# EAGLE design usb (EAGLE 9.2.2)
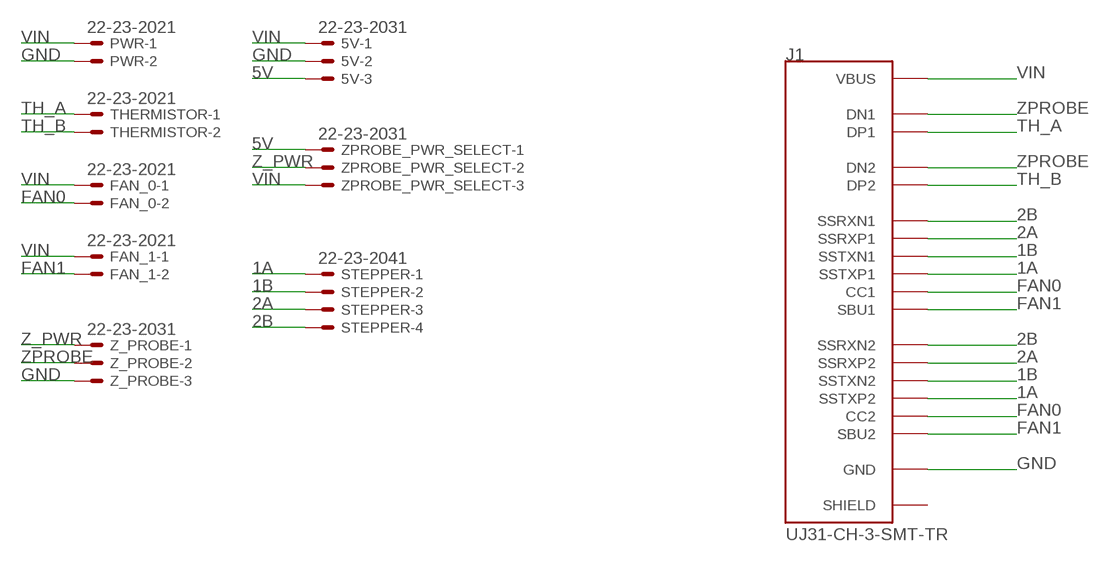
[diagram p0: schematic, sheet 1]

## Parts
5V  22-23-2031  [22-23-2031]
FAN_0  22-23-2021  [22-23-2021]
FAN_1  22-23-2021  [22-23-2021]
J1  UJ31-CH-3-SMT-TR  [CUI_UJ31-CH-3-SMT-TR]
PWR  22-23-2021  [22-23-2021]
STEPPER  22-23-2041  [22-23-2041]
THERMISTOR  22-23-2021  [22-23-2021]
Z_PROBE  22-23-2031  [22-23-2031]
ZPROBE_PWR_SELECT  22-23-2031  [22-23-2031]

## Nets
1A: J1.A2(SSTXP1) J1.B2(SSTXP2) STEPPER.1
1B: J1.A3(SSTXN1) J1.B3(SSTXN2) STEPPER.2
2A: J1.A11(SSRXP2) J1.B11(SSRXP1) STEPPER.3
2B: J1.A10(SSRXN2) J1.B10(SSRXN1) STEPPER.4
5V: 5V.3 ZPROBE_PWR_SELECT.1
FAN0: FAN_0.2 J1.A5(CC1) J1.B5(CC2)
FAN1: FAN_1.2 J1.A8(SBU1) J1.B8(SBU2)
GND: 5V.2 J1.A1(GND) J1.A12(GND) J1.B1(GND) J1.B12(GND) PWR.2 Z_PROBE.3
TH_A: J1.A6(DP1) THERMISTOR.1
TH_B: J1.B6(DP2) THERMISTOR.2
VIN: 5V.1 FAN_0.1 FAN_1.1 J1.A4(VBUS) J1.A9(VBUS) J1.B4(VBUS) J1.B9(VBUS) PWR.1 ZPROBE_PWR_SELECT.3
Z_PWR: Z_PROBE.1 ZPROBE_PWR_SELECT.2
ZPROBE: J1.A7(DN1) J1.B7(DN2) Z_PROBE.2

## Power pins joined to a net without a drawn wire
SHIELD: J1.SH1(SHIELD) J1.SH2(SHIELD) J1.SH3(SHIELD) J1.SH4(SHIELD) J1.SH5(SHIELD) J1.SH6(SHIELD)

## Library data of the parts
5V Z_PROBE ZPROBE_PWR_SELECT = con-molex:22-23-2031: .100" (2.54mm) Center Header - 3 Pin; MF: MOLEX; MPN: 22-23-2031; OC_FARNELL: 1462950; OC_NEWARK: 30C0862
FAN_0 FAN_1 PWR THERMISTOR = con-molex:22-23-2021: .100" (2.54mm) Center Header - 2 Pin; MF: MOLEX; MPN: 22-23-2021; OC_FARNELL: 1462926; OC_NEWARK: 25C3832
J1 = UJ31-CH-3-SMT-TR:UJ31-CH-3-SMT-TR: Type C, USB 3.0/3.1 Gen 1, Right Angle, Surface Mount (SMT), USB Receptacle; MANUFACTURER: CUI INC; PART_REV: 1.01; STANDARD: MANUFACTURER RECOMMENDATIONS
STEPPER = con-molex:22-23-2041: .100" (2.54mm) Center Header - 4 Pin; MF: MOLEX; MPN: 22-23-2041; OC_FARNELL: 1462920; OC_NEWARK: 38C0355

## Board
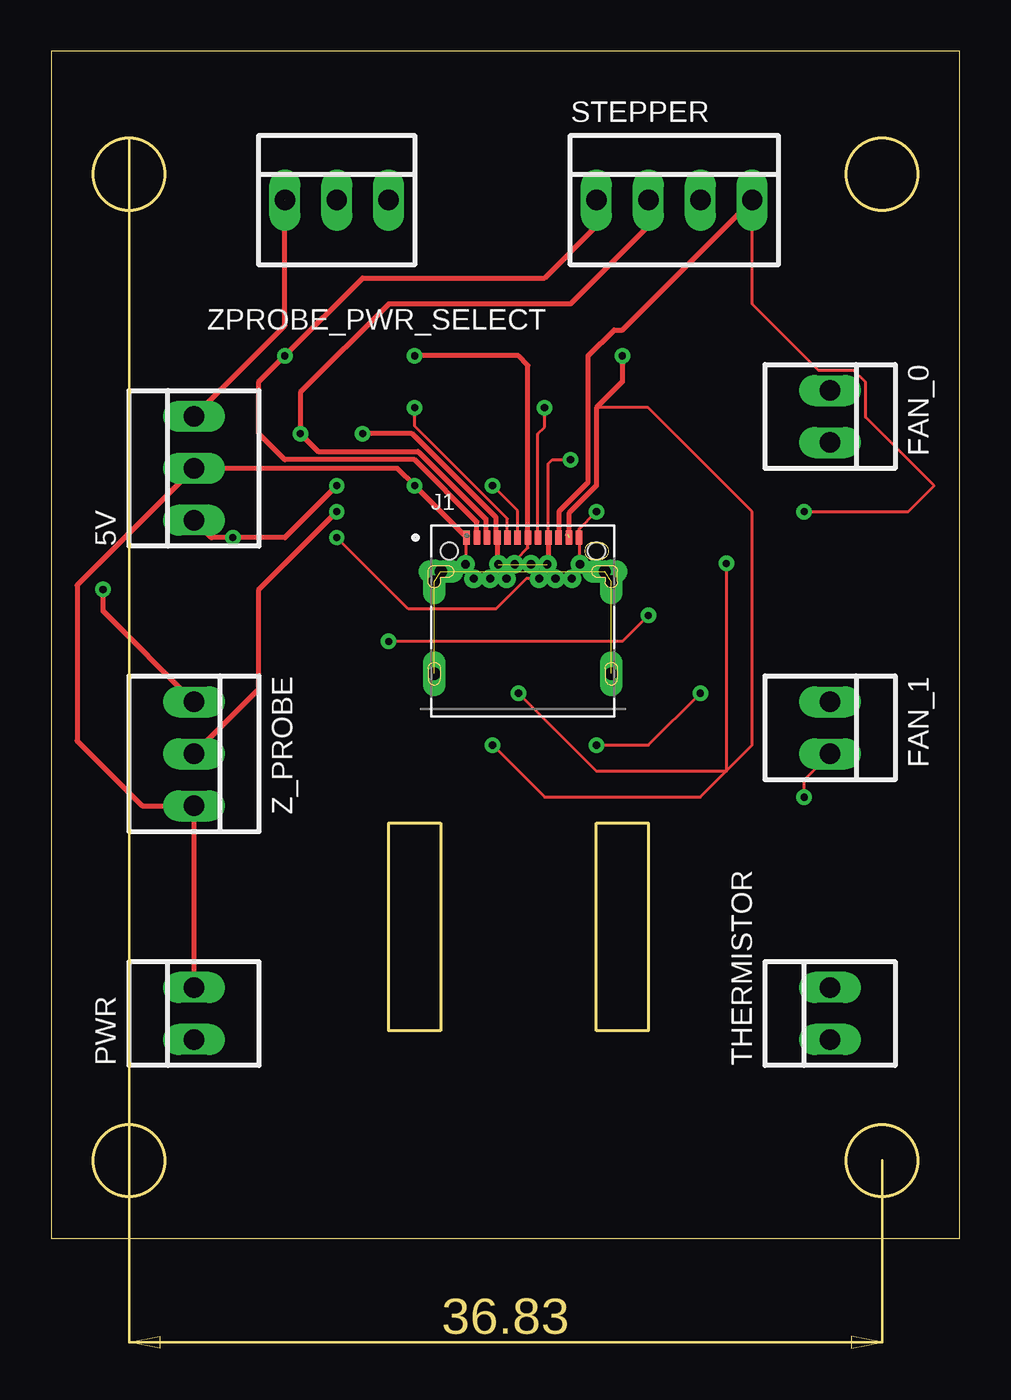
[diagram p1: board, top side]
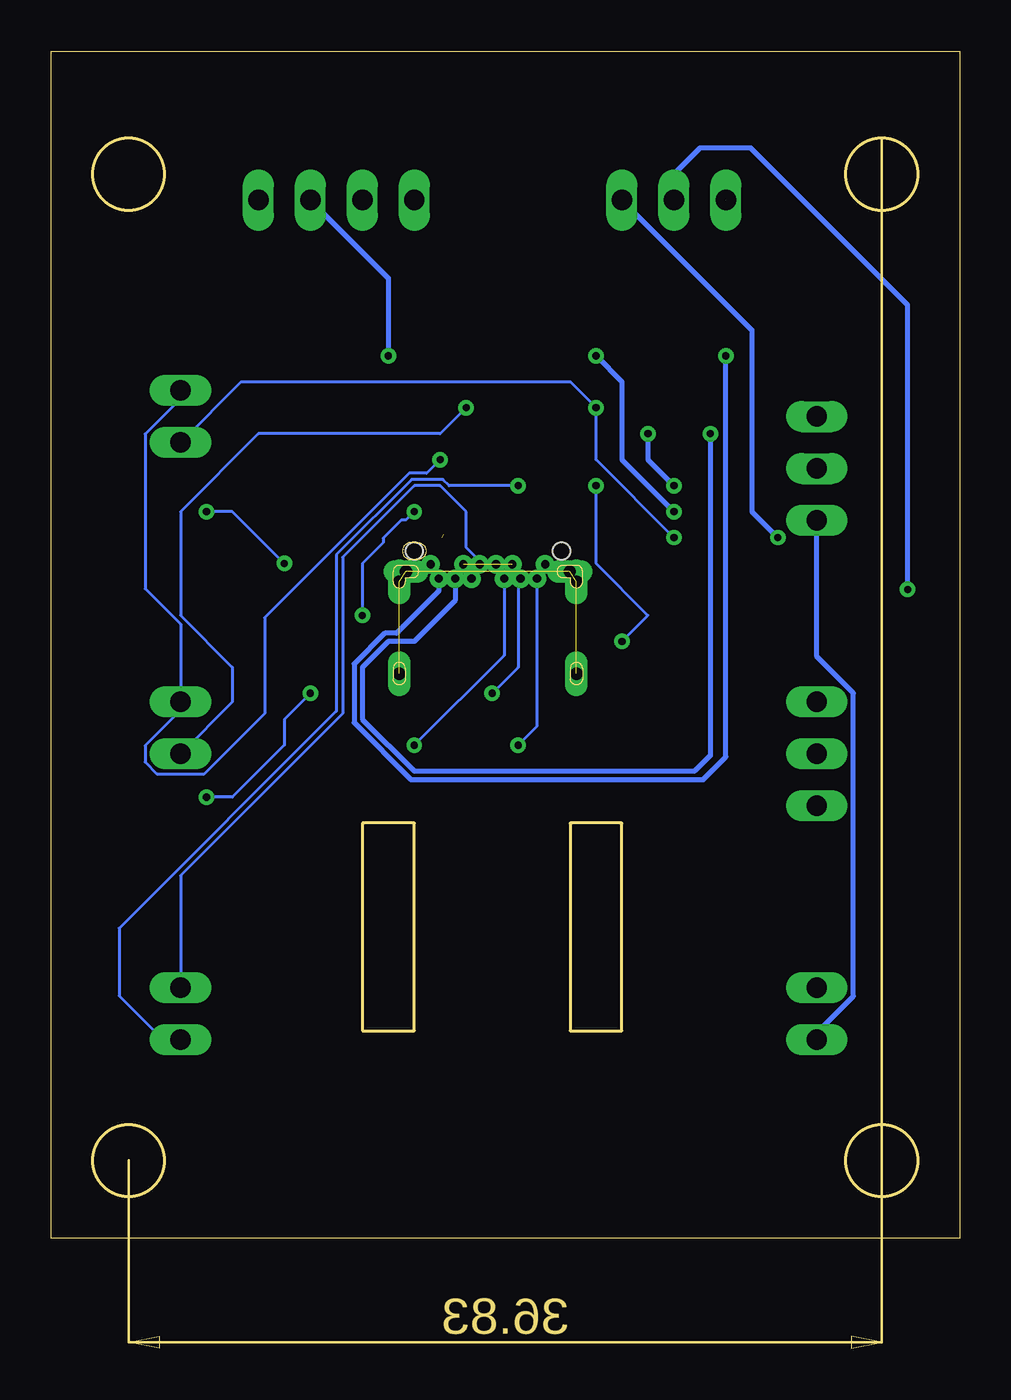
[diagram p2: board, bottom side, seen from below]

Size 44.43 x 58.09 mm. Coordinates in mm from the lower left corner, seen from the top.
Outline: 0,0 44.43,0 44.43,58.09 0,58.09 0,0
Outline: 16.51,20.32 19.05,20.32 19.05,10.16 16.51,10.16 16.51,20.32
Outline: 26.67,20.32 29.21,20.32 29.21,10.16 26.67,10.16 26.67,20.32
Outline: circle at 3.81,52.07 radius 1.75
Outline: circle at 40.64,52.07 radius 1.75
Outline: circle at 3.81,3.81 radius 1.75
Outline: circle at 40.64,3.81 radius 1.75
Copper layers (1*16): Top 0.035mm / dielectric 1.5mm / Bottom 0.035mm
Design rules "default": minimum track width 6mil, minimum drill 0.35mm, track to track 6mil, track to pad 6mil, pad to pad 6mil, via to via 6mil, smd to smd 6mil, copper to edge 40mil, drill to drill 6mil, minimum pad ring 10mil, minimum via ring 8mil, stop-mask expansion 4mil, vias tented up to drill 0mil, thermal gap 10mil

### Footprints (pad centres in the part's own frame; a part is rotated, then mirrored left to right if it is on the bottom)
22-23-2031 = drill 1 long: 1 -2.54,0; 2 0,0; 3 2.54,0
22-23-2021 = drill 1 long: 1 -1.27,0; 2 1.27,0
CUI_UJ31-CH-3-SMT-TR = smd 0.32 x 0.7: A1 0,0; A2 0.5,0; A3 1,0; A4 1.5,0; A5 2,0; A6 2.5,0; A7 3,0; A8 3.5,0; A9 4,0; A10 4.5,0; A11 5,0; A12 5.5,0 | drill 0.4 pad 0.6: B1 5.55,-1.31; B2 5.15,-2.01; B3 4.35,-2.01; B4 3.95,-1.31; B5 3.55,-2.01; B6 3.15,-1.31; B7 2.35,-1.31; B8 1.95,-2.01; B9 1.55,-1.31; B10 1.15,-2.01; B11 0.35,-2.01; B12 -0.05,-1.31 | drill 0.6 pad 0.8 long: SH1 -1.255,-1.66; SH2 6.755,-1.66 | drill 0.6 pad 0.9 long: SH3 -1.58,-2.16; SH4 7.08,-2.16; SH5 -1.58,-6.66; SH6 7.08,-6.66 | hole 0.85: -0.85,-0.66; 6.35,-0.66
22-23-2041 = drill 1 long: 1 -3.81,0; 2 -1.27,0; 3 1.27,0; 4 3.81,0

### Placement (x,y rotation side)
5V  6.99,37.68 90 top
FAN_0  38.1,40.22 270 top
FAN_1  38.1,24.98 270 top
J1  20.32,34.29 0 top
PWR  6.99,11.01 90 top
STEPPER  30.48,50.8 0 top
THERMISTOR  38.1,11.01 90 top
Z_PROBE  6.99,23.71 270 top
ZPROBE_PWR_SELECT  13.97,50.8 0 top

### Tracks (layer width: path | path; a pad name or v marks a point on that pad's centre or on a via)
1A  (via drill 0.35)
  Top 0.254: J1.A2 20.82,35.06 17.78,38.1 11.43,38.1 10.16,39.37 10.16,41.91 v11.43,43.18 15.24,46.99 24.13,46.99 26.67,49.53 | STEPPER.1 26.67,49.53 | 26.67,49.53
  Bottom 0.254: J1.B2 25.47,31.68 27.53,29.62 28.11,29.62 29.62,28.11 29.62,25.23 26.84,22.45 12.53,22.45 11.43,23.55 v11.43,43.18
1B  (via drill 0.35)
  Top 0.254: STEPPER.2 29.21,49.53 25.4,45.72 16.51,45.72 12.19,41.4 v12.19,39.37 13.06,38.51 17.95,38.51 21.26,35.2 21.26,34.35 J1.A3
  Bottom 0.254: v12.19,39.37 12.19,23.62 12.95,22.86 26.67,22.86 29.21,25.4 29.21,27.94 27.94,29.21 26.67,29.21 24.67,31.21 J1.B3
2A  (via drill 0.35)  (1 unrouted)
  Top 0.152: v21.59,24.13 24.13,21.59 31.75,21.59 34.29,24.13 34.29,35.56 29.21,40.64 26.67,40.64
  Top 0.254: v27.94,43.18 27.94,41.91 26.67,40.64 26.67,36.83 25.32,35.48 25.32,34.5 25.26,34.44
  Bottom 0.152: J1.B11 20.67,25.05 v21.59,24.13
  Bottom 0.254: STEPPER.3 27.94,46.99 v27.94,43.18
2B  (via drill 0.35)
  Top 0.152: v22.86,26.67 26.67,22.86 33.02,22.86 v33.02,33.02 | v36.83,35.56 41.91,35.56 43.18,36.83 39.84,40.17 39.84,41.89 39.26,42.47 37.54,42.47 34.29,45.72 STEPPER.4
  Top 0.254: STEPPER.4 27.94,44.45 27.53,44.45 26.26,43.18 26.26,37 24.85,35.59 24.85,34.32 J1.A10
  Bottom 0.152: v22.86,26.67 21.59,27.94 21.59,32.16 J1.B10 | v33.02,33.02 35.56,35.56 v36.83,35.56
5V  (1 unrouted)
  Top 0.254: 5V.3 11.43,44.66 ZPROBE_PWR_SELECT.1
FAN0  (via drill 0.35)
  Top 0.152: J1.A5 22.32,35.21 17.78,39.75 v17.78,40.64 | J1.B5 23.23,32.28 21.75,30.79 17.47,30.79 v13.97,34.29
  Bottom 0.152: FAN_0.2 35.14,41.91 19.05,41.91 v17.78,40.64 17.78,38.1 v13.97,34.29
FAN1  (via drill 0.35)
  Top 0.152: J1.A8 23.8,34.31 23.8,39.37 24.13,39.7 v24.13,40.64 | v26.67,24.13 29.21,24.13 v31.75,26.67 | v36.83,21.59 36.83,22.44 FAN_1.2
  Bottom 0.152: FAN_1.2 35.56,26.25 35.56,27.94 38.1,30.48 38.1,35.56 34.29,39.37 25.4,39.37 v24.13,40.64 | J1.B8 22.27,28.53 v26.67,24.13 | v31.75,26.67 33.02,25.4 33.02,24.13 35.56,21.59 v36.83,21.59
GND  (via drill 0.35)
  Top 0.152: v26.67,35.56 25.82,34.71 J1.A12 25.82,33.03 J1.B1 | J1.A1 20.27,34.24 J1.B12 | v29.21,30.48 27.94,29.21 v16.51,29.21
  Top 0.254: J1.A1 v17.78,36.83 16.93,37.68 5V.2 1.27,31.96 1.27,24.34 4.45,21.17 Z_PROBE.3 PWR.2
  Bottom 0.152: v26.67,35.56 27.08,35.15 27.3,35.15 28.19,34.26 28.19,34.04 29.21,33.02 v29.21,30.48 | v16.51,29.21 15.24,30.48 17.78,33.02 v17.78,36.83
SHIELD  (5 unrouted)
TH_A  (via drill 0.35)
  Top 0.152: J1.A6 22.82,35.6 v21.59,36.83
  Bottom 0.152: v21.59,36.83 24.97,36.83 25.27,37.13 26.8,37.13 30.48,33.45 30.48,33.02 | 30.48,33.02 | 30.48,33.02 30.48,25.8 41.11,15.18 41.11,11.87 38.97,9.74 THERMISTOR.1
TH_B
  Bottom 0.152: J1.B6 23.59,33.1 23.59,33.26 24.13,33.8 24.13,35.56 25.4,36.83 26.67,36.83 30.18,33.33 30.18,25.68 38.1,17.75 THERMISTOR.2
VIN  (via drill 0.35)  (1 unrouted)
  Top 0.152: J1.A9 24.32,37.91 24.51,38.1 v25.4,38.1
  Top 0.254: J1.B9 21.82,33.03 J1.A4 21.76,34.35 21.76,35.27 17.66,39.37 v15.24,39.37 | J1.A9 24.32,33.03 J1.B4 | v13.97,36.83 11.43,34.29 v8.89,34.29 7.83,34.29 5V.1
  Bottom 0.152: FAN_0.1 38.1,41.09 39.84,39.35 39.84,31.79 38.1,30.05 FAN_1.1 38.1,25.85 39.84,24.11 39.84,23.3 39.26,22.72 36.94,22.72 33.98,25.68 33.98,30.38 26.92,37.44 26.06,37.44 v25.4,38.1
  Bottom 0.254: ZPROBE_PWR_SELECT.3 10.16,44.45 10.16,35.56 v8.89,34.29 | PWR.1 6.99,10.06 5.2,11.85 5.2,26.68 6.99,28.46 5V.1 | v15.24,39.37 15.24,38.1 v13.97,36.83
Z_PWR  (via drill 0.35)
  Top 0.254: Z_PROBE.1 2.54,30.69 v2.54,31.75
  Bottom 0.254: ZPROBE_PWR_SELECT.2 13.97,52.07 12.7,53.34 10.21,53.34 2.54,45.67 v2.54,31.75
ZPROBE  (via drill 0.35)
  Top 0.152: J1.B7 22.79,33.1 22.79,33.26 23.32,33.8 J1.A7
  Top 0.254: J1.A7 23.32,42.72 22.86,43.18 v17.78,43.18 | v13.97,35.56 10.16,31.75 10.16,26.88 Z_PROBE.2
  Bottom 0.254: v17.78,43.18 16.51,41.91 16.51,38.1 v13.97,35.56